# Altium schematic sheet DC-Motor-DRV.SchDoc: DC Motor Driver
size Tabloid; DocumentNumber: LM-004; Revision: A; SheetNumber: 1; SheetTotal: 4
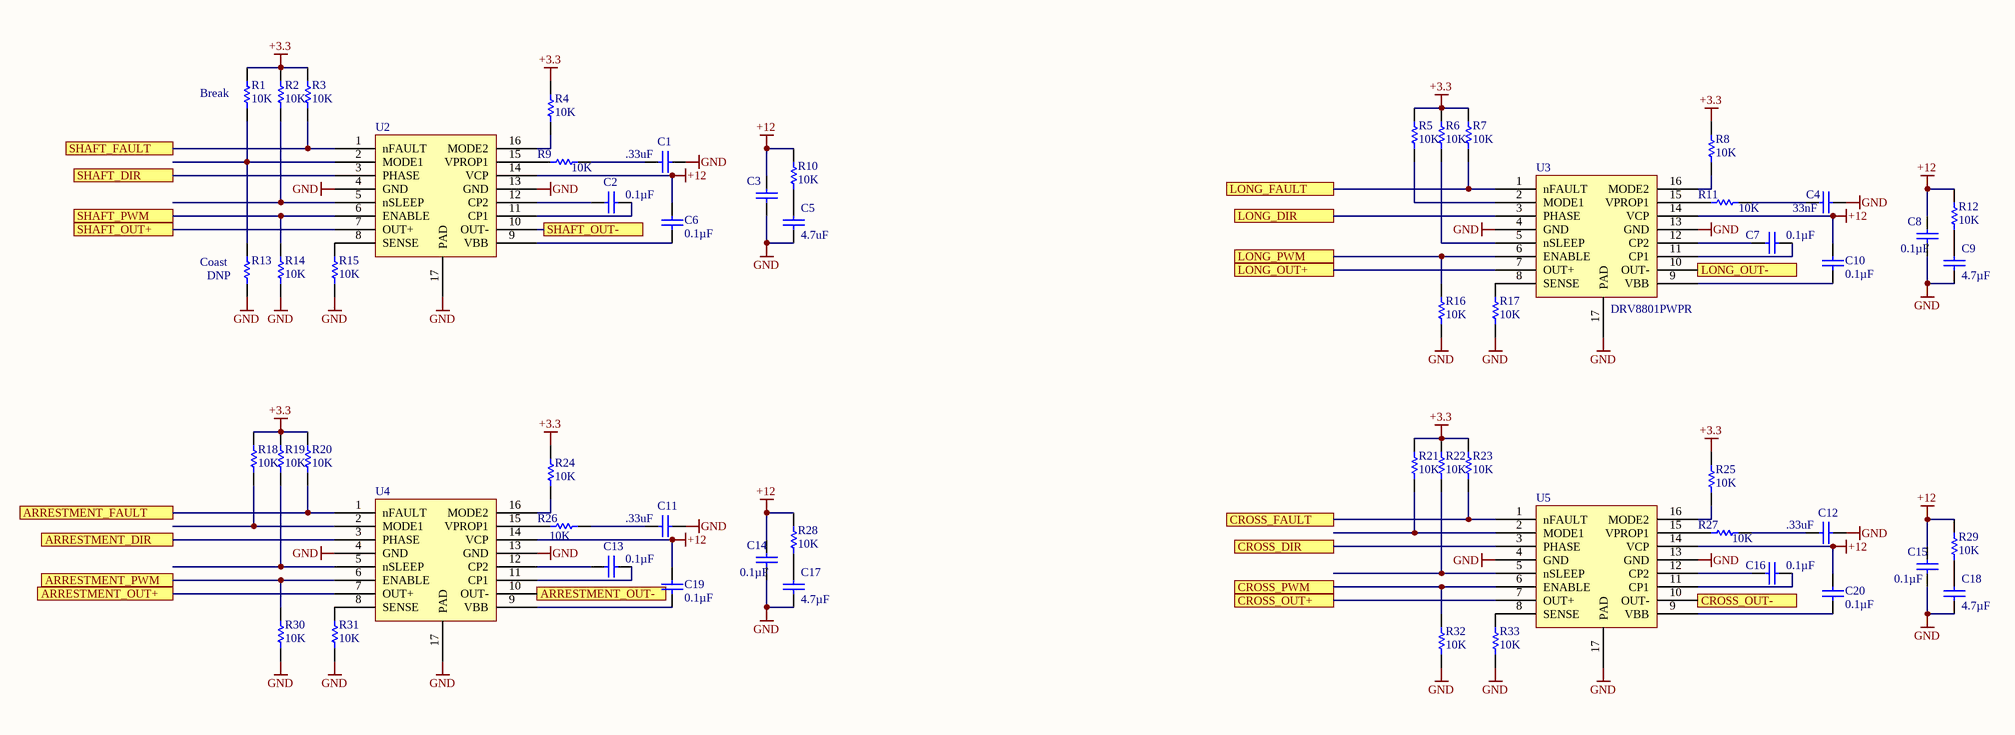
[diagram p0: DC-Motor-DRV.SchDoc]

## Parts
C1  .33uF  [CAPC0805(2012)145_N]
C2  Capacitance: 0.1µF  [CAPC0805(2012)145_N]  (hidden comment: 0.1uF)
C3  0.1uF  [CAPC0805(2012)145_N]  (value not drawn)
C4  33nF  [CAPC0402(1005)60_L]
C5  4.7uF  [CAPC0805(2012)145_N]
C6  Capacitance: 0.1µF  [CAPC0805(2012)145_N]  (hidden comment: 0.1uF)
C7  Capacitance: 0.1µF  [CAPC0805(2012)145_N]  (hidden comment: 0.1uF)
C8  Capacitance: 0.1µF  [CAPC0805(2012)145_N]  (hidden comment: .1uF)
C9  Capacitance: 4.7µF  [CAPC0805(2012)145_N]  (hidden comment: 4.7uF)
C10  Capacitance: 0.1µF  [CAPC0805(2012)145_N]  (hidden comment: .1uF)
C11  .33uF  [CAPC0805(2012)145_N]
C12  .33uF  [CAPC0805(2012)145_N]
C13  Capacitance: 0.1µF  [CAPC0805(2012)145_N]  (hidden comment: CAP CER 0.1UF 25V X7R 0805)
C14  Capacitance: 0.1µF  [CAPC0805(2012)145_N]  (hidden comment: CAP CER 0.1UF 25V X7R 0805)
C15  Capacitance: 0.1µF  [CAPC0805(2012)145_N]  (hidden comment: 0.1uF)
C16  Capacitance: 0.1µF  [CAPC0805(2012)145_N]  (hidden comment: 0.1uF)
C17  Capacitance: 4.7µF  [CAPC0805(2012)145_N]  (hidden comment: CAP CER 0.1UF 25V X7R 0805)
C18  Capacitance: 4.7µF  [CAPC0805(2012)145_N]  (hidden comment: 4.7uF)
C19  Capacitance: 0.1µF  [CAPC0805(2012)145_N]  (hidden comment: CAP CER 0.1UF 25V X7R 0805)
C20  Capacitance: 0.1µF  [CAPC0805(2012)145_N]  (hidden comment: 0.1uF)
R1  10K  [RESC0805(2012)_L]
R2  10K  [RESC0805(2012)_L]
R3  10K  [RESC0805(2012)_L]
R4  10K  [RESC0805(2012)_L]
R5  10K  [RESC0805(2012)_L]
R6  10K  [RESC0805(2012)_L]
R7  10K  [RESC0805(2012)_L]
R8  10K  [RESC0805(2012)_L]
R9  10K  [RESC0805(2012)_L]
R10  10K  [RESC0805(2012)_L]
R11  10K  [RESC0805(2012)_L]
R12  10K  [RESC0805(2012)_L]
R13  DNP  [RESC0805(2012)_L]
R14  10K  [RESC0805(2012)_L]
R15  10K  [RESC0805(2012)_L]
R16  10K  [RESC0805(2012)_L]
R17  10K  [RESC0805(2012)_L]
R18  10K  [RESC0805(2012)_L]
R19  10K  [RESC0805(2012)_L]
R20  10K  [RESC0805(2012)_L]
R21  10K  [RESC0805(2012)_L]
R22  10K  [RESC0805(2012)_L]
R23  10K  [RESC0805(2012)_L]
R24  10K  [RESC0805(2012)_L]
R25  10K  [RESC0805(2012)_L]
R26  10K  [RESC0805(2012)_L]
R27  10K  [RESC0805(2012)_L]
R28  10K  [RESC0805(2012)_L]
R29  10K  [RESC0805(2012)_L]
R30  10K  [RESC0805(2012)_L]
R31  10K  [RESC0805(2012)_L]
R32  10K  [RESC0805(2012)_L]
R33  10K  [RESC0805(2012)_L]
U2  DRV8801PWPR  [DRV8801PWPR]  (value not drawn)
U3  DRV8801PWPR  [DRV8801PWPR]
U4  DRV8801PWPR  [DRV8801PWPR]  (value not drawn)
U5  DRV8801PWPR  [DRV8801PWPR]  (value not drawn)

## Ports
ARRESTMENT_DIR, ARRESTMENT_FAULT, ARRESTMENT_OUT+, ARRESTMENT_OUT-, ARRESTMENT_PWM, CROSS_DIR, CROSS_FAULT, CROSS_OUT+, CROSS_OUT-, CROSS_PWM, LONG_DIR, LONG_FAULT, LONG_OUT+, LONG_OUT-, LONG_PWM, SHAFT_DIR, SHAFT_FAULT, SHAFT_OUT+, SHAFT_OUT-, SHAFT_PWM

## Nets
+3.3: R1.1 R2.1 R3.1 R4.1 R5.1 R6.1 R7.1 R8.1 R18.1 R19.1 R20.1 R21.1 R22.1 R23.1 R24.1 R25.1
+12: C3.1 C6.2 C8.1 C10.2 C14.1 C15.1 C19.2 C20.2 R10.1 R12.1 R28.1 R29.1 U2.14(VCP) U3.14(VCP) U4.14(VCP) U5.14(VCP)
GND: C1.1 C3.2 C4.2 C5.2 C8.2 C9.2 C11.1 C12.1 C14.2 C15.2 C17.2 C18.2 R13.2 R14.2 R15.2 R16.2 R17.2 R30.2 R31.2 R32.2 R33.2 U2.4(GND) U2.13(GND) U2.17(PAD) U3.4(GND) U3.13(GND) U3.17(PAD) U4.4(GND) U4.13(GND) U4.17(PAD) U5.4(GND) U5.13(GND) U5.17(PAD)
ARRESTMENT_DIR: U4.3(PHASE) ; port ARRESTMENT_DIR
ARRESTMENT_FAULT: R20.2 U4.1(nFAULT) ; port ARRESTMENT_FAULT
ARRESTMENT_OUT+: U4.7(OUT+) ; port ARRESTMENT_OUT+
ARRESTMENT_OUT-: U4.10(OUT-) ; port ARRESTMENT_OUT-
ARRESTMENT_PWM: R30.1 U4.6(ENABLE) ; port ARRESTMENT_PWM
CROSS_DIR: U5.3(PHASE) ; port CROSS_DIR
CROSS_FAULT: R23.2 U5.1(nFAULT) ; port CROSS_FAULT
CROSS_OUT+: U5.7(OUT+) ; port CROSS_OUT+
CROSS_OUT-: U5.10(OUT-) ; port CROSS_OUT-
CROSS_PWM: R32.1 U5.6(ENABLE) ; port CROSS_PWM
LONG_DIR: U3.3(PHASE) ; port LONG_DIR
LONG_FAULT: R7.2 U3.1(nFAULT) ; port LONG_FAULT
LONG_OUT+: U3.7(OUT+) ; port LONG_OUT+
LONG_OUT-: U3.10(OUT-) ; port LONG_OUT-
LONG_PWM: R16.1 U3.6(ENABLE) ; port LONG_PWM
SHAFT_DIR: U2.3(PHASE) ; port SHAFT_DIR
SHAFT_FAULT: R3.2 U2.1(nFAULT) ; port SHAFT_FAULT
SHAFT_OUT+: U2.7(OUT+) ; port SHAFT_OUT+
SHAFT_OUT-: U2.10(OUT-) ; port SHAFT_OUT-
SHAFT_PWM: R14.1 U2.6(ENABLE) ; port SHAFT_PWM
NetC1_2: C1.2 R9.1
NetC2_1: C2.1 U2.12(CP2)
NetC2_2: C2.2 U2.11(CP1)
NetC4_1: C4.1 R11.1
NetC5_1: C5.1 R10.2
NetC6_1: C6.1 U2.9(VBB)
NetC7_1: C7.1 U3.12(CP2)
NetC7_2: C7.2 U3.11(CP1)
NetC9_1: C9.1 R12.2
NetC10_1: C10.1 U3.9(VBB)
NetC11_2: C11.2 R26.1
NetC12_2: C12.2 R27.1
NetC13_1: C13.1 U4.12(CP2)
NetC13_2: C13.2 U4.11(CP1)
NetC16_1: C16.1 U5.12(CP2)
NetC16_2: C16.2 U5.11(CP1)
NetC17_1: C17.1 R28.2
NetC18_1: C18.1 R29.2
NetC19_1: C19.1 U4.9(VBB)
NetC20_1: C20.1 U5.9(VBB)
NetR1_2: R1.2 R13.1 U2.2(MODE1)
NetR2_2: R2.2 U2.5(nSLEEP)
NetR4_2: R4.2 U2.16(MODE2)
NetR5_2: R5.2 U3.2(MODE1)
NetR6_2: R6.2 U3.5(nSLEEP)
NetR8_2: R8.2 U3.16(MODE2)
NetR9_2: R9.2 U2.15(VPROP1)
NetR11_2: R11.2 U3.15(VPROP1)
NetR15_1: R15.1 U2.8(SENSE)
NetR17_1: R17.1 U3.8(SENSE)
NetR18_2: R18.2 U4.2(MODE1)
NetR19_2: R19.2 U4.5(nSLEEP)
NetR21_2: R21.2 U5.2(MODE1)
NetR22_2: R22.2 U5.5(nSLEEP)
NetR24_2: R24.2 U4.16(MODE2)
NetR25_2: R25.2 U5.16(MODE2)
NetR26_2: R26.2 U4.15(VPROP1)
NetR27_2: R27.2 U5.15(VPROP1)
NetR31_1: R31.1 U4.8(SENSE)
NetR33_1: R33.1 U5.8(SENSE)

## Notes on the sheet
- (near R1) Break
- (near R13) Coast
- Title
- Size:
- Date:
- Tabloid
- Number:
- Time:
- Revision:
- Sheet
- of
- ZLS Corporation
- 7801 North Lamar Blvd.
- Suite E-184
- Austin, Texas 78752  USA
- (512) 453-0288
- File:

## Library data of the parts
C1 C11 C12 = CMP-1036-04795-1: CAP CER 0.1UF 25V X7R 0805; Manufacturer: Wurth Electronics Inc.; Manufacturer Part Number: 885012207069; Description: CAP CER 0.033UF 25V X7R 0805; Tolerance: ±10%; Notification: Current market demand for these product types have resulted in fluctuating and extending lead times. Lead times may differ.; Supplier 1: Digi-Key; Supplier Part Number 1: 732-8058-6-ND; RoHS: RoHS Compliant; Category: Capacitors; Stock 1: 1331; Pricing 1: 1=0.1, 10=0.04, 100=0.0359, 500=0.0318 (USD); Packaging: Digi-Reel®; Part Status: Active; Voltage - Rated: 25V; Temperature Coefficient: X7R; Operating Temperature: -55°C ~ 125°C; Features: -; Ratings: -; Applications: General Purpose; Mounting Type: Surface Mount, MLCC; Package / Case: 0805 (2012 Metric); Size / Dimension: 0.079" L x 0.049" W (2.00mm x 1.25mm); Height - Seated (Max): -; Thickness (Max): 0.035" (0.90mm); Lead Spacing: -; Lead Style: -; ComponentLink1URL: https://katalog.we-online.de/pbs/datasheet/885012207069.pdf; ComponentLink1Description: https://katalog.we-online.de/pbs/datasheet/885012207069.pdf
C2 C6-C8 C10 C15 C16 C20 = CMP-1036-04795-1: CAP CER 0.1UF 25V X7R 0805; Manufacturer: Murata Electronics North America; Manufacturer Part Number: GRM21BR71E104KA01L; Tolerance: ±10%; Supplier 1: Digi-Key; Supplier Part Number 1: 490-1673-6-ND; RoHS: RoHS Compliant; Category: Capacitors; Stock 1: 891652; Pricing 1: 1=0.2, 10=0.145, 100=0.0683, 500=0.04788, 1000=0.03964 (USD); Packaging: Digi-Reel®; Part Status: Active; Voltage - Rated: 25V; Temperature Coefficient: X7R; Operating Temperature: -55°C ~ 125°C; Features: -; Ratings: -; Applications: General Purpose; Mounting Type: Surface Mount, MLCC; Package / Case: 0805 (2012 Metric); Size / Dimension: 0.079" L x 0.049" W (2.00mm x 1.25mm); Height - Seated (Max): -; Thickness (Max): 0.053" (1.35mm); Lead Spacing: -; Lead Style: -; ComponentLink1URL: http://www.murata.com/~/media/webrenewal/support/library/catalog/products/capacitor/mlcc/c02e.ashx; ComponentLink1Description: http://www.murata.com/~/media/webrenewal/support/library/catalog/products/capacitor/mlcc/c02e.ashx
C3 = CMP-1036-04795-1: CAP CER 0.1UF 25V X7R 0805; Manufacturer: Murata Electronics North America; Manufacturer Part Number: GRM21BR71E104KA01L; Capacitance: 0.1µF; Tolerance: ±10%; Supplier 1: Digi-Key; Supplier Part Number 1: 490-1673-6-ND; RoHS: RoHS Compliant; Category: Capacitors; Stock 1: 891652; Pricing 1: 1=0.2, 10=0.145, 100=0.0683, 500=0.04788, 1000=0.03964 (USD); Packaging: Digi-Reel®; Part Status: Active; Voltage - Rated: 25V; Temperature Coefficient: X7R; Operating Temperature: -55°C ~ 125°C; Features: -; Ratings: -; Applications: General Purpose; Mounting Type: Surface Mount, MLCC; Package / Case: 0805 (2012 Metric); Size / Dimension: 0.079" L x 0.049" W (2.00mm x 1.25mm); Height - Seated (Max): -; Thickness (Max): 0.053" (1.35mm); Lead Spacing: -; Lead Style: -; ComponentLink1URL: http://www.murata.com/~/media/webrenewal/support/library/catalog/products/capacitor/mlcc/c02e.ashx; ComponentLink1Description: http://www.murata.com/~/media/webrenewal/support/library/catalog/products/capacitor/mlcc/c02e.ashx
C4 = CMP-1034-00252-1: CAP CER 33UF 10V X7R 0402; Manufacturer: Murata Electronics North America; Manufacturer Part Number: GRM155R71A104KA01D; Tolerance: ±10%; Supplier 1: Digi-Key; Supplier Part Number 1: 490-6321-1-ND; RoHS: RoHS Compliant; Category: Capacitors; Stock 1: 2920395; Pricing 1: 1=0.1, 10=0.014, 100=0.0063, 500=0.00446, 1000=0.00351, 2500=0.00319, 5000=0.00293 (USD); Packaging: Cut Tape (CT); Part Status: Active; Voltage - Rated: 10V; Temperature Coefficient: X7R; Operating Temperature: -55°C ~ 125°C; Features: -; Ratings: -; Applications: General Purpose; Mounting Type: Surface Mount, MLCC; Package / Case: 0402 (1005 Metric); Size / Dimension: 0.039" L x 0.020" W (1.00mm x 0.50mm); Height - Seated (Max): -; Thickness (Max): 0.022" (0.55mm); Lead Spacing: -; ComponentLink1URL: http://www.murata.com/~/media/webrenewal/support/library/catalog/products/capacitor/mlcc/c02e.ashx?la=en-us; ComponentLink1Description: http://www.murata.com/~/media/webrenewal/support/library/catalog/products/capacitor/mlcc/c02e.ashx?la=en-us
C5 = CMP-1036-04795-1: CAP CER 4.7UF 25V 10% X7R 0805; Manufacturer: Murata Electronics North America; Manufacturer Part Number: GRM21BR71E104KA01L; Capacitance: 4.7µF; Supplier 1: Digi-Key; Supplier Part Number 1: 490-1673-6-ND; RoHS: RoHS Compliant; Category: Capacitors; Stock 1: 891652; Pricing 1: 1=0.2, 10=0.145, 100=0.0683, 500=0.04788, 1000=0.03964 (USD); Packaging: Digi-Reel®; Part Status: Active; Tolerance: ±10%; Voltage - Rated: 25V; Temperature Coefficient: X7R; Operating Temperature: -55°C ~ 125°C; Features: -; Ratings: -; Applications: General Purpose; Mounting Type: Surface Mount, MLCC; Package / Case: 0805 (2012 Metric); Size / Dimension: 0.079" L x 0.049" W (2.00mm x 1.25mm); Height - Seated (Max): -; Thickness (Max): 0.053" (1.35mm); Lead Spacing: -; Lead Style: -; ComponentLink1URL: http://www.murata.com/~/media/webrenewal/support/library/catalog/products/capacitor/mlcc/c02e.ashx; ComponentLink1Description: http://www.murata.com/~/media/webrenewal/support/library/catalog/products/capacitor/mlcc/c02e.ashx
C9 C18 = CMP-1036-04795-1: CAP CER 4.7UF 25V X7R 0805; Manufacturer: Murata Electronics North America; Manufacturer Part Number: GRM21BR71E104KA01L; Tolerance: ±10%; Supplier 1: Digi-Key; Supplier Part Number 1: 490-1673-6-ND; RoHS: RoHS Compliant; Category: Capacitors; Stock 1: 891652; Pricing 1: 1=0.2, 10=0.145, 100=0.0683, 500=0.04788, 1000=0.03964 (USD); Packaging: Digi-Reel®; Part Status: Active; Voltage - Rated: 25V; Temperature Coefficient: X7R; Operating Temperature: -55°C ~ 125°C; Features: -; Ratings: -; Applications: General Purpose; Mounting Type: Surface Mount, MLCC; Package / Case: 0805 (2012 Metric); Size / Dimension: 0.079" L x 0.049" W (2.00mm x 1.25mm); Height - Seated (Max): -; Thickness (Max): 0.053" (1.35mm); Lead Spacing: -; Lead Style: -; ComponentLink1URL: http://www.murata.com/~/media/webrenewal/support/library/catalog/products/capacitor/mlcc/c02e.ashx; ComponentLink1Description: http://www.murata.com/~/media/webrenewal/support/library/catalog/products/capacitor/mlcc/c02e.ashx
C13 C14 C19 = CMP-1036-04795-1: Manufacturer: Murata Electronics North America; Manufacturer Part Number: GRM21BR71E104KA01L; Tolerance: ±10%; Supplier 1: Digi-Key; Supplier Part Number 1: 490-1673-6-ND; RoHS: RoHS Compliant; Category: Capacitors; Stock 1: 891652; Pricing 1: 1=0.2, 10=0.145, 100=0.0683, 500=0.04788, 1000=0.03964 (USD); Packaging: Digi-Reel®; Part Status: Active; Voltage - Rated: 25V; Temperature Coefficient: X7R; Operating Temperature: -55°C ~ 125°C; Features: -; Ratings: -; Applications: General Purpose; Mounting Type: Surface Mount, MLCC; Package / Case: 0805 (2012 Metric); Size / Dimension: 0.079" L x 0.049" W (2.00mm x 1.25mm); Height - Seated (Max): -; Thickness (Max): 0.053" (1.35mm); Lead Spacing: -; Lead Style: -; ComponentLink1URL: http://www.murata.com/~/media/webrenewal/support/library/catalog/products/capacitor/mlcc/c02e.ashx; ComponentLink1Description: http://www.murata.com/~/media/webrenewal/support/library/catalog/products/capacitor/mlcc/c02e.ashx
C17 = CMP-1036-04795-1: CAP CER 0.47UF 25V X7R 0805; Manufacturer: Murata Electronics North America; Manufacturer Part Number: GRM21BR71E104KA01L; Tolerance: ±10%; Supplier 1: Digi-Key; Supplier Part Number 1: 490-1673-6-ND; RoHS: RoHS Compliant; Category: Capacitors; Stock 1: 891652; Pricing 1: 1=0.2, 10=0.145, 100=0.0683, 500=0.04788, 1000=0.03964 (USD); Packaging: Digi-Reel®; Part Status: Active; Voltage - Rated: 25V; Temperature Coefficient: X7R; Operating Temperature: -55°C ~ 125°C; Features: -; Ratings: -; Applications: General Purpose; Mounting Type: Surface Mount, MLCC; Package / Case: 0805 (2012 Metric); Size / Dimension: 0.079" L x 0.049" W (2.00mm x 1.25mm); Height - Seated (Max): -; Thickness (Max): 0.053" (1.35mm); Lead Spacing: -; Lead Style: -; ComponentLink1URL: http://www.murata.com/~/media/webrenewal/support/library/catalog/products/capacitor/mlcc/c02e.ashx; ComponentLink1Description: http://www.murata.com/~/media/webrenewal/support/library/catalog/products/capacitor/mlcc/c02e.ashx
R1-R9 R11 R13-R27 R30-R33 = CMP-1013-00215-1: RES SMD 10K OHM 1% 1/8W 0805; Manufacturer: Vishay Dale; Manufacturer Part Number: CRCW080510K0FKEA; Power (Watts): 0.125W, 1/8W; Temperature Coefficient: ±100ppm/°C; Supplier 1: Digi-Key; Supplier Part Number 1: 541-10.0KCCT-ND; RoHS: RoHS Compliant; Category: Resistors; Stock 1: 1104982; Pricing 1: 1=0.1, 10=0.055, 100=0.0223, 1000=0.01003, 2500=0.0087 (USD); Packaging: Cut Tape (CT); Part Status: Active; Tolerance: ±1%; Composition: Thick Film; Features: Automotive AEC-Q200; Operating Temperature: -55°C ~ 155°C; Package / Case: 0805 (2012 Metric); Supplier Device Package: 0805; Size / Dimension: 0.079" L x 0.049" W (2.00mm x 1.25mm); Height - Seated (Max): 0.020" (0.50mm); Failure Rate: -; ComponentLink1URL: http://www.vishay.com/docs/20035/dcrcwe3.pdf; ComponentLink1Description: http://www.vishay.com/docs/20035/dcrcwe3.pdf
R10 R12 R28 R29 = CMP-1013-00215-1: RES SMD 1R OHM 1% 1/8W 0805; Manufacturer: Vishay Dale; Manufacturer Part Number: CRCW080510K0FKEA; Power (Watts): 0.125W, 1/8W; Temperature Coefficient: ±100ppm/°C; Supplier 1: Digi-Key; Supplier Part Number 1: 541-10.0KCCT-ND; RoHS: RoHS Compliant; Category: Resistors; Stock 1: 1104982; Pricing 1: 1=0.1, 10=0.055, 100=0.0223, 1000=0.01003, 2500=0.0087 (USD); Packaging: Cut Tape (CT); Part Status: Active; Tolerance: ±1%; Composition: Thick Film; Features: Automotive AEC-Q200; Operating Temperature: -55°C ~ 155°C; Package / Case: 0805 (2012 Metric); Supplier Device Package: 0805; Size / Dimension: 0.079" L x 0.049" W (2.00mm x 1.25mm); Height - Seated (Max): 0.020" (0.50mm); Failure Rate: -; ComponentLink1URL: http://www.vishay.com/docs/20035/dcrcwe3.pdf; ComponentLink1Description: http://www.vishay.com/docs/20035/dcrcwe3.pdf
U2-U5 = DRV8801PWPR: IC MOTOR DRIVER PAR 16HTSSOP; Manufacturer: Texas Instruments; Motor Type - Stepper: Bipolar; Motor Type - AC, DC: Brushed DC; Function: Driver - Fully Integrated, Control and Power Stage; Output Configuration: Half Bridge (2); Interface: Parallel; Current - Output: 2.8A; Voltage - Supply: 8 V ~ 38 V; Supplier 1: Digi-Key; Supplier Part Number 1: 296-25378-1-ND; Manufacturer Part Number: DRV8801PWPR; RoHS: RoHS Compliant; Category: Integrated Circuits (ICs); Stock 1: 44037; Pricing 1: 1=2.11, 10=1.892, 100=1.5204, 500=1.24914, 1000=1.035 (USD); Packaging: Cut Tape (CT); Part Status: Active; Technology: DMOS; Step Resolution: -; Applications: General Purpose; Voltage - Load: 8 V ~ 38 V; Operating Temperature: -40°C ~ 150°C (TJ); Mounting Type: Surface Mount; Package / Case: 16-TSSOP (0.173", 4.40mm Width) Exposed Pad; Supplier Device Package: 16-HTSSOP; Base Part Number: DRV8801; ComponentLink1URL: http://www.ti.com/lit/ds/symlink/drv8801.pdf; ComponentLink1Description: http://www.ti.com/lit/ds/symlink/drv8801.pdf